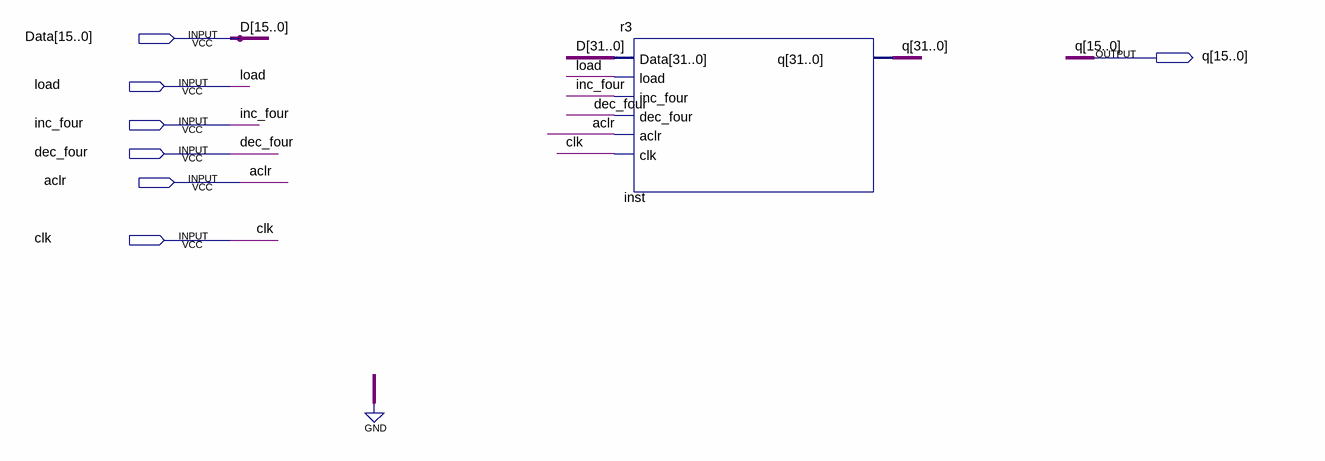
[diagram p0: schematic sheet]
// Quartus schematic r3_16bit.bdf as structural Verilog: 1 symbols, 7 pins
module r3_16bit (
  input  [15:0] Data,
  input  load,
  input  inc_four,
  input  dec_four,
  input  aclr,
  input  clk,
  output [31:0] q
);

  wire [31:16] D;

  r3 inst (.Data({D, Data}), .load(load), .inc_four(inc_four), .dec_four(dec_four), .aclr(aclr), .clk(clk), .q(q));

  // Other names for the same wires on the sheet: D[15:0] = Data
endmodule
